# Altium schematic sheet DCDC_stepdown.SchDoc
size 381 x 304 mm; DrawnBy: Constanza Barriga
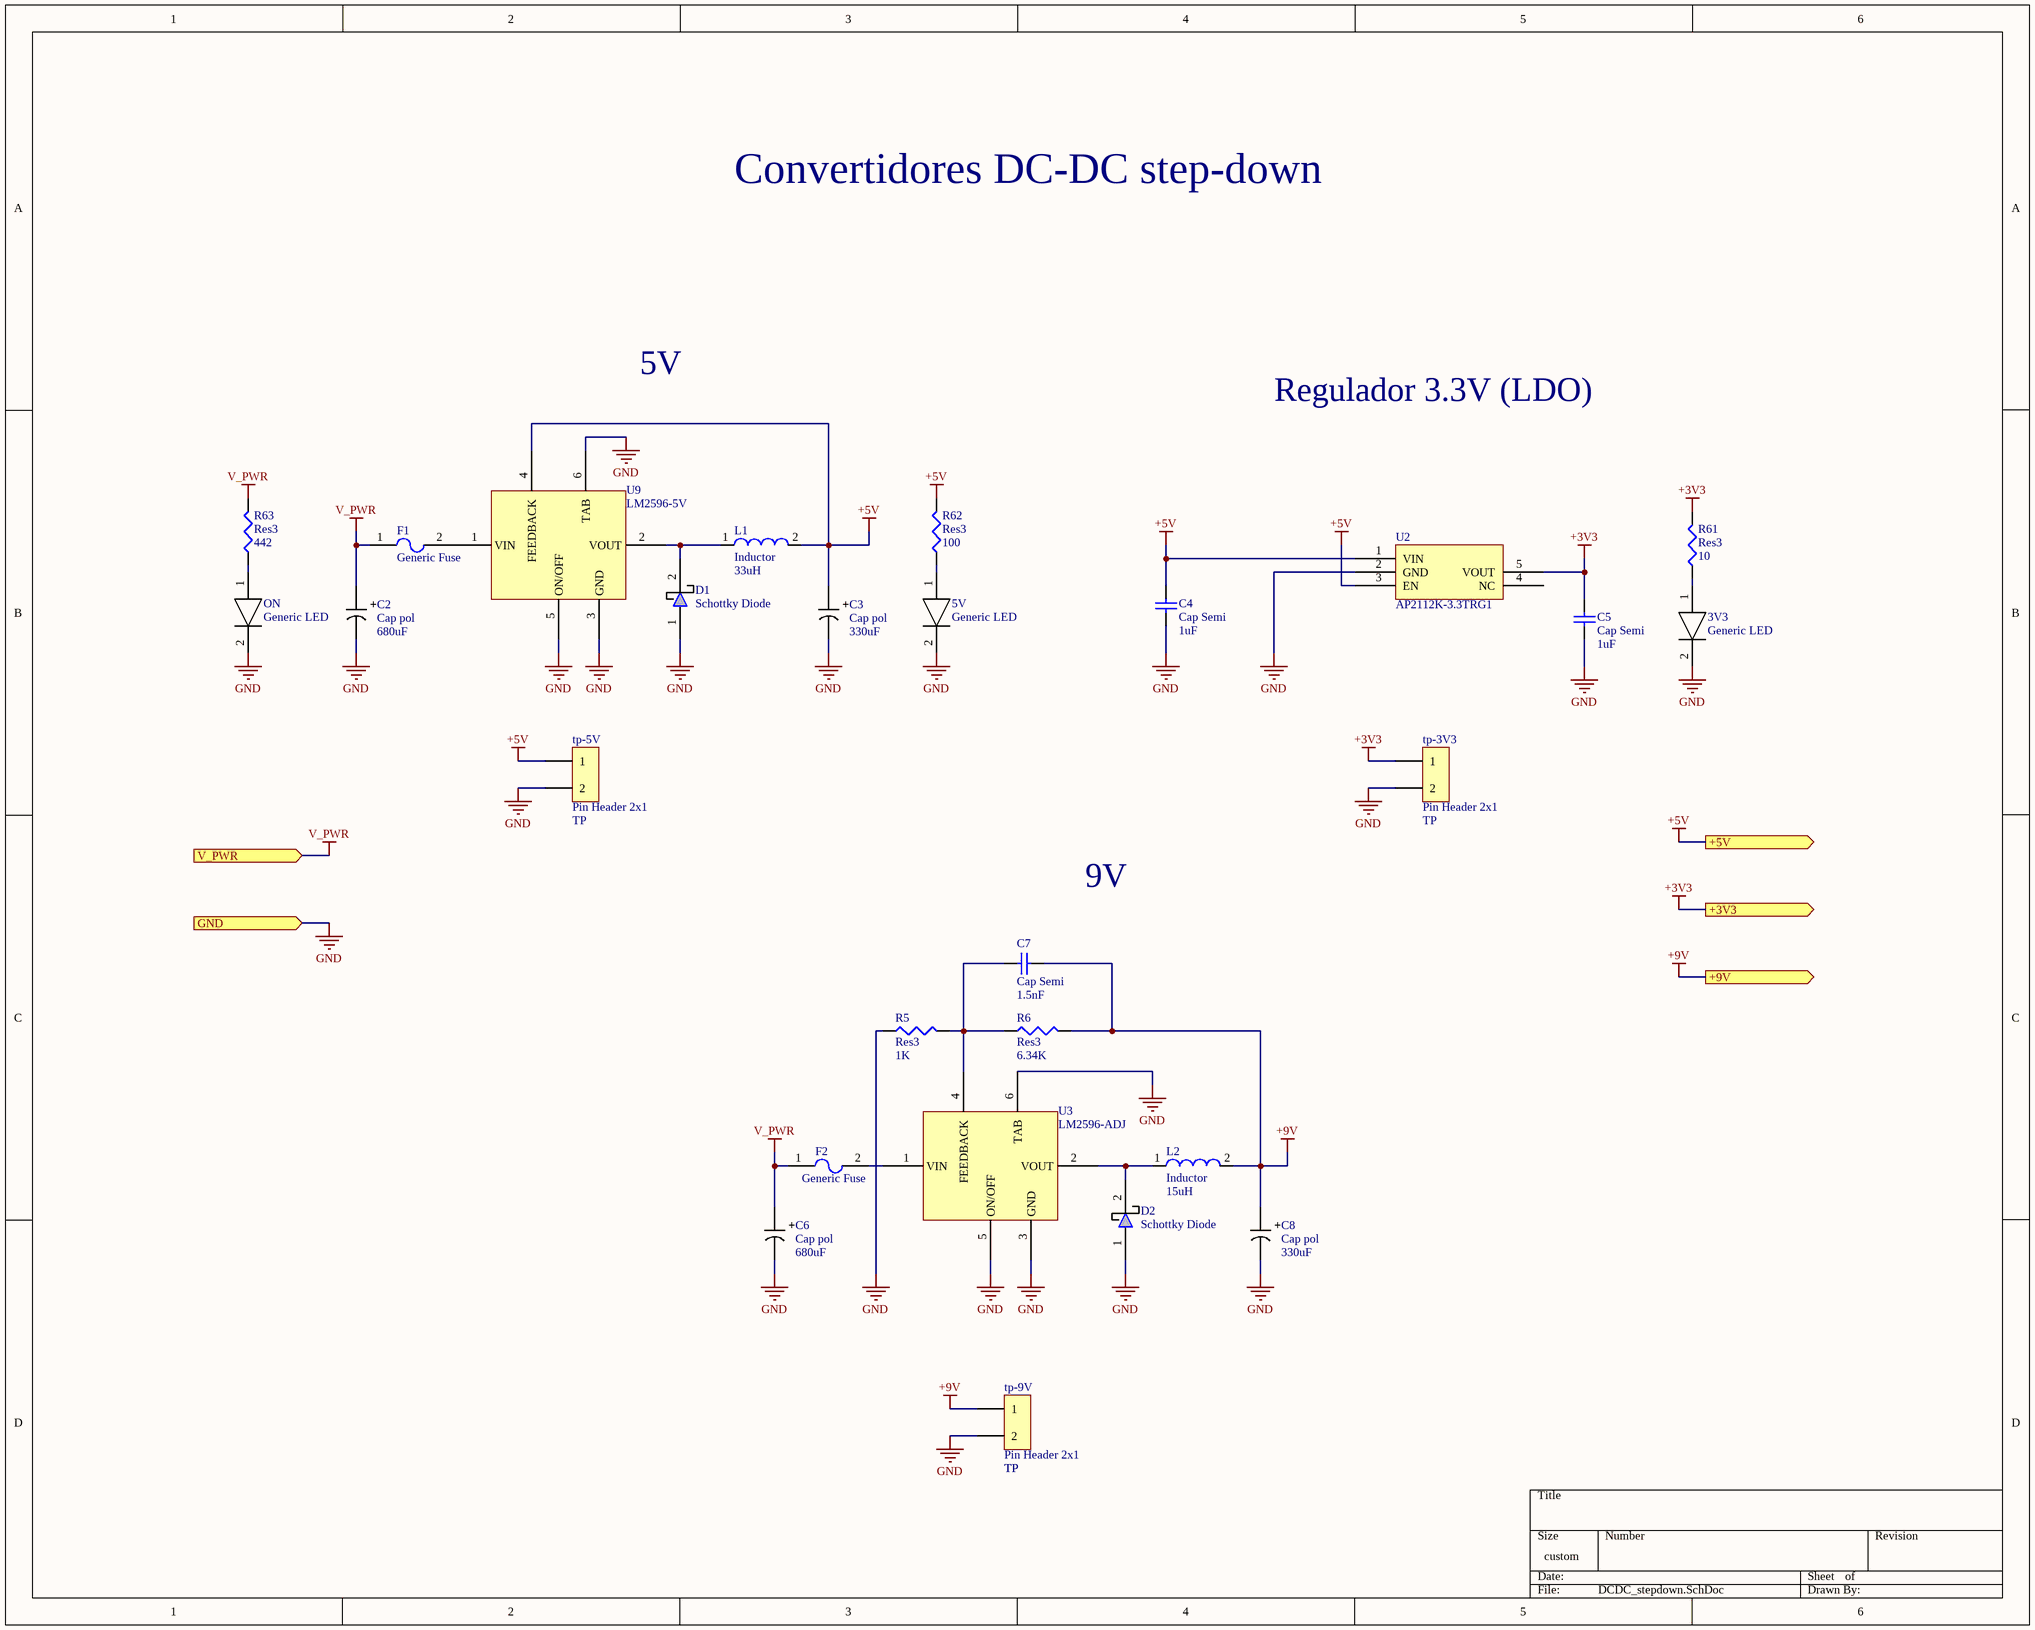
[diagram p0: DCDC_stepdown.SchDoc]

## Parts
3V3  Generic LED  [LED0603]
5V  Generic LED  [LED0603]
C2  Cap pol  value 680uF  [CAP_SMD_Electrolytic_13.5x13.5]
C3  Cap pol  value 330uF  [CAP_SMD_Electrolytic_10x10]
C4  Cap Semi  value 1uF  [1608[0603]]
C5  Cap Semi  value 1uF  [1608[0603]]
C6  Cap pol  value 680uF  [CAP_SMD_Electrolytic_13.5x13.5]
C7  Cap Semi  value 1.5nF  [1608[0603]]
C8  Cap pol  value 330uF  [CAP_SMD_Electrolytic_10x10]
D1  Schottky Diode  [SMB_L4.6-W3.6-LS5.3-RD]
D2  Schottky Diode  [SMB_L4.6-W3.6-LS5.3-RD]
F1  Generic Fuse  [F1206]
F2  Generic Fuse  [F1206]
L1  Inductor  value 33uH  [IND-SMD_L12.5-W12.5_SMDRS1275]
L2  Inductor  value 15uH  [IND-SMD_L8.0-W8.0]
ON  Generic LED  [LED0603]
R5  Res3  value 1K  [J1-0603]
R6  Res3  value 6.34K  [J1-0603]
R61  Res3  value 10  [J1-0603]
R62  Res3  value 100  [J1-0603]
R63  Res3  value 442  [J1-0603]
tp-3V3  Pin Header 2x1  [HDR-TH_P2.54-H-M_A2541WV-2P]
tp-5V  Pin Header 2x1  [HDR-TH_P2.54-H-M_A2541WV-2P]
tp-9V  Pin Header 2x1  [HDR-TH_P2.54-H-M_A2541WV-2P]
U2  AP2112K-3.3TRG1  [SOT25-5]
U3  LM2596-ADJ  [TO-263-5]
U9  LM2596-5V  [TO-263-5]

## Ports
+3V3 (out), +5V (out), +9V (out), GND (in), V_PWR (in)

## Nets
+3V3: C5.2 R61.2 tp-3V3.1 U2.5(VOUT) ; port +3V3
+5V: C3.2 C4.2 L1.2 R62.2 tp-5V.1 U2.1(VIN) U2.3(EN) U9.4(FEEDBACK) ; port +5V
+9V: C7.2 C8.2 L2.2 R6.2 tp-9V.1 ; port +9V
GND: 3V3.2 5V.2 C2.1 C3.1 C4.1 C5.1 C6.1 C8.1 D1.1(+) D2.1(+) ON.2 R5.1 tp-3V3.2 tp-5V.2 tp-9V.2 U2.2(GND) U3.3(GND) U3.5(ON/OFF) U3.6(TAB) U9.3(GND) U9.5(ON/OFF) U9.6(TAB) ; port GND
V_PWR: C2.2 C6.2 F1.1 F2.1 R63.2 ; port V_PWR
Net3V3_1: 3V3.1 R61.1
Net5V_1: 5V.1 R62.1
NetC7_1: C7.1 R5.2 R6.1 U3.4(FEEDBACK)
NetD1_2: D1.2(-) L1.1 U9.2(VOUT)
NetD2_2: D2.2(-) L2.1 U3.2(VOUT)
NetF1_2: F1.2 U9.1(VIN)
NetF2_2: F2.2 U3.1(VIN)
NetON_1: ON.1 R63.1

Not connected (* = marked no-connect by the designer): U2 4(NC)

## Notes on the sheet
- Convertidores DC-DC step-down
- 5V
- Regulador 3.3V (LDO)
- (near tp-5V) TP
- (near tp-3V3) TP
- 9V
- (near tp-9V) TP
- (in symbol Cap pol) +

## Library data of the parts
3V3 5V ON = LED: Generic LED SMD; Manufacturer: Lite-On; Manufacturer Part Number: LTST-C191TGKT; Package: 0603; Color: Green; Supplier 1: LCSC; Supplier Part Number 1: C125101
C2 C6 = Cap pol: Electrolytic Aluminium Capacitor; Manufacturer: PANASONIC; Manufacturer Part Number: EEEFK1V681AQ; Voltage: 35V; Supplier 1: LCSC; Supplier Part Number 1: C178568; Package: SMD,12.5x13.5mm
C3 C8 = Cap pol: Electrolytic Aluminium Capacitor; Manufacturer: PANASONIC; Manufacturer Part Number: EEE1VA331UAP; Voltage: 35V; Supplier 1: LCSC; Supplier Part Number 1: C336488; Package: SMD, 10X10mm
C4 C5 = Cap Semi: Capacitor (Semiconductor SIM Model); Manufacturer: Samsung Electro-Mechanics; Manufacturer Part Number: CL10B105KO8NNNC; Published: 8-Jun-2000; LatestRevisionDate: 29-May-2009; LatestRevisionNote: IPC-7351 Footprint Added.; PackageReference: C0603; Publisher: Altium Limited; PackageDescription: Chip Capacitor; Supplier 1: LCSC; Supplier Part Number 1: C59782
C7 = Cap Semi: Capacitor (Semiconductor SIM Model); Manufacturer: Walsin Tech Corp; Manufacturer Part Number: 0603B152K500; Published: 8-Jun-2000; LatestRevisionDate: 29-May-2009; LatestRevisionNote: IPC-7351 Footprint Added.; PackageReference: C0603; Publisher: Altium Limited; PackageDescription: Chip Capacitor; Supplier 1: LCSC; Supplier Part Number 1: C152947
D1 D2 = Schottky Diode: Schottky Diodes; Manufacturer: MCC(Micro Commercial Components); Manufacturer Part Number: SK32B-LTP; Reverse voltage: 20V; Package: SMB; Supplier 1: LCSC; Supplier Part Number 1: C139945
F1 F2 = FUSE: SMD Fuse; Manufacturer: AEM; Manufacturer Part Number: F1206VH4500TM; Rated Voltage AC: 65V; Current Rating: 4.5A; Supplier 1: LCSC; Supplier Part Number 1: C310980; Package: 1206
L1 = Inductor: Inductor SMD; Manufacturer: GLE; Manufacturer Part Number: GCRH127M-330MC; Supplier 1: LCSC; Supplier Part Number 1: C439422; Package: SMD,12.3x12.3x8mm
L2 = Inductor: Inductor SMD; Manufacturer: 3L COILS; Manufacturer Part Number: SNR8040K-150M; Supplier 1: LCSC; Supplier Part Number 1: C326353; Package: SMD,8.0x8.0mm
R5 = Res3: Resistor; Manufacturer: KAMAYA; Manufacturer Part Number: RMC16K102FTP; Published: 8-Jun-2000; LatestRevisionDate: 29-May-2009; LatestRevisionNote: IPC-7351 Footprint Added.; PackageReference: J1-0603; Publisher: Altium Limited; PackageDescription: Chip Resistor; Supplier 1: LCSC; Supplier Part Number 1: C323557
R6 = Res3: Resistor; Manufacturer: YAGEO; Manufacturer Part Number: RC0603FR-076K34L; Published: 8-Jun-2000; LatestRevisionDate: 29-May-2009; LatestRevisionNote: IPC-7351 Footprint Added.; PackageReference: J1-0603; Publisher: Altium Limited; PackageDescription: Chip Resistor; Supplier 1: LCSC; Supplier Part Number 1: C185314
R61 = Res3: Resistor; Manufacturer Part Number: RC0603FR-0710RL; Manufacturer: YAGEO; Published: 8-Jun-2000; LatestRevisionDate: 29-May-2009; LatestRevisionNote: IPC-7351 Footprint Added.; PackageReference: J1-0603; Publisher: Altium Limited; PackageDescription: Chip Resistor; Supplier 1: LCSC; Supplier Part Number 1: C109318
R62 = Res3: Resistor; Manufacturer Part Number: RC0603FR-07100RL; Manufacturer: YAGEO; Published: 8-Jun-2000; LatestRevisionDate: 29-May-2009; LatestRevisionNote: IPC-7351 Footprint Added.; PackageReference: J1-0603; Publisher: Altium Limited; PackageDescription: Chip Resistor; Supplier 1: LCSC; Supplier Part Number 1: C105588
R63 = Res3: Resistor; Manufacturer Part Number: AC0603FR-07442RL; Manufacturer: YAGEO; Published: 8-Jun-2000; LatestRevisionDate: 29-May-2009; LatestRevisionNote: IPC-7351 Footprint Added.; PackageReference: J1-0603; Publisher: Altium Limited; PackageDescription: Chip Resistor; Supplier 1: LCSC; Supplier Part Number 1: C227905
tp-3V3 tp-5V tp-9V = Header - 2x1c: Pin Header 2pos, 1 row, 2.54 pitch; Manufacturer: CJT(Changjiang Connectors); Manufacturer Part Number: A2541WV-2P; Pitch: 2.54; Supplier 1: LCSC; Supplier Part Number 1: C225477
U2 = AP2112K-3.3: 600mA CMOS LDO REGULATOR WITH ENABLE; Manufacturer: DIODES; Package: SOT-25-5_L3.0-W1.8-P0.95-LS3.0-BL; Supplier 1: LCSC; Supplier Part Number 1: C51118; Manufacturer Part Number: AP2112K-3.3TRG1
U3 = LM2596-ADJ: DC-DC Converters Step-Down Adjustable 1 4.5V 40V 1.2V 37V 3A TO-263-5 RoHS; Manufacturer: Texas Instruments; Manufacturer Part Number: LM2596SX-ADJ/NOPB; Package: TO-263-5; Supplier 1: LCSC; Supplier Part Number 1: C29781
U9 = LM2596-5V: Step-Down Positive Fixed 1 3A 150kHz TO-263-5 DC-DC Converters RoHS; Manufacturer: HTC Korea TAEJIN Tech; Manufacturer Part Number: LM2596R-5.0; Package: TO-263-5; Supplier 1: LCSC; Supplier Part Number 1: C77782